# Altium schematic sheet Э3.SchDoc: =title_line_1 + title_line_2
size 420 x 297 mm; ApprovedBy: Мерзлякова; CheckedBy: Кутузов; DrawnBy: Площадная; DocumentNumber: Э3; SheetNumber: 1; SheetTotal: 2; title_line_1: плата; title_line_2: ЕТЗ; document_type: схема электрическая принципиальная; check: Кутузов; AprovedBy: Мерзлякова
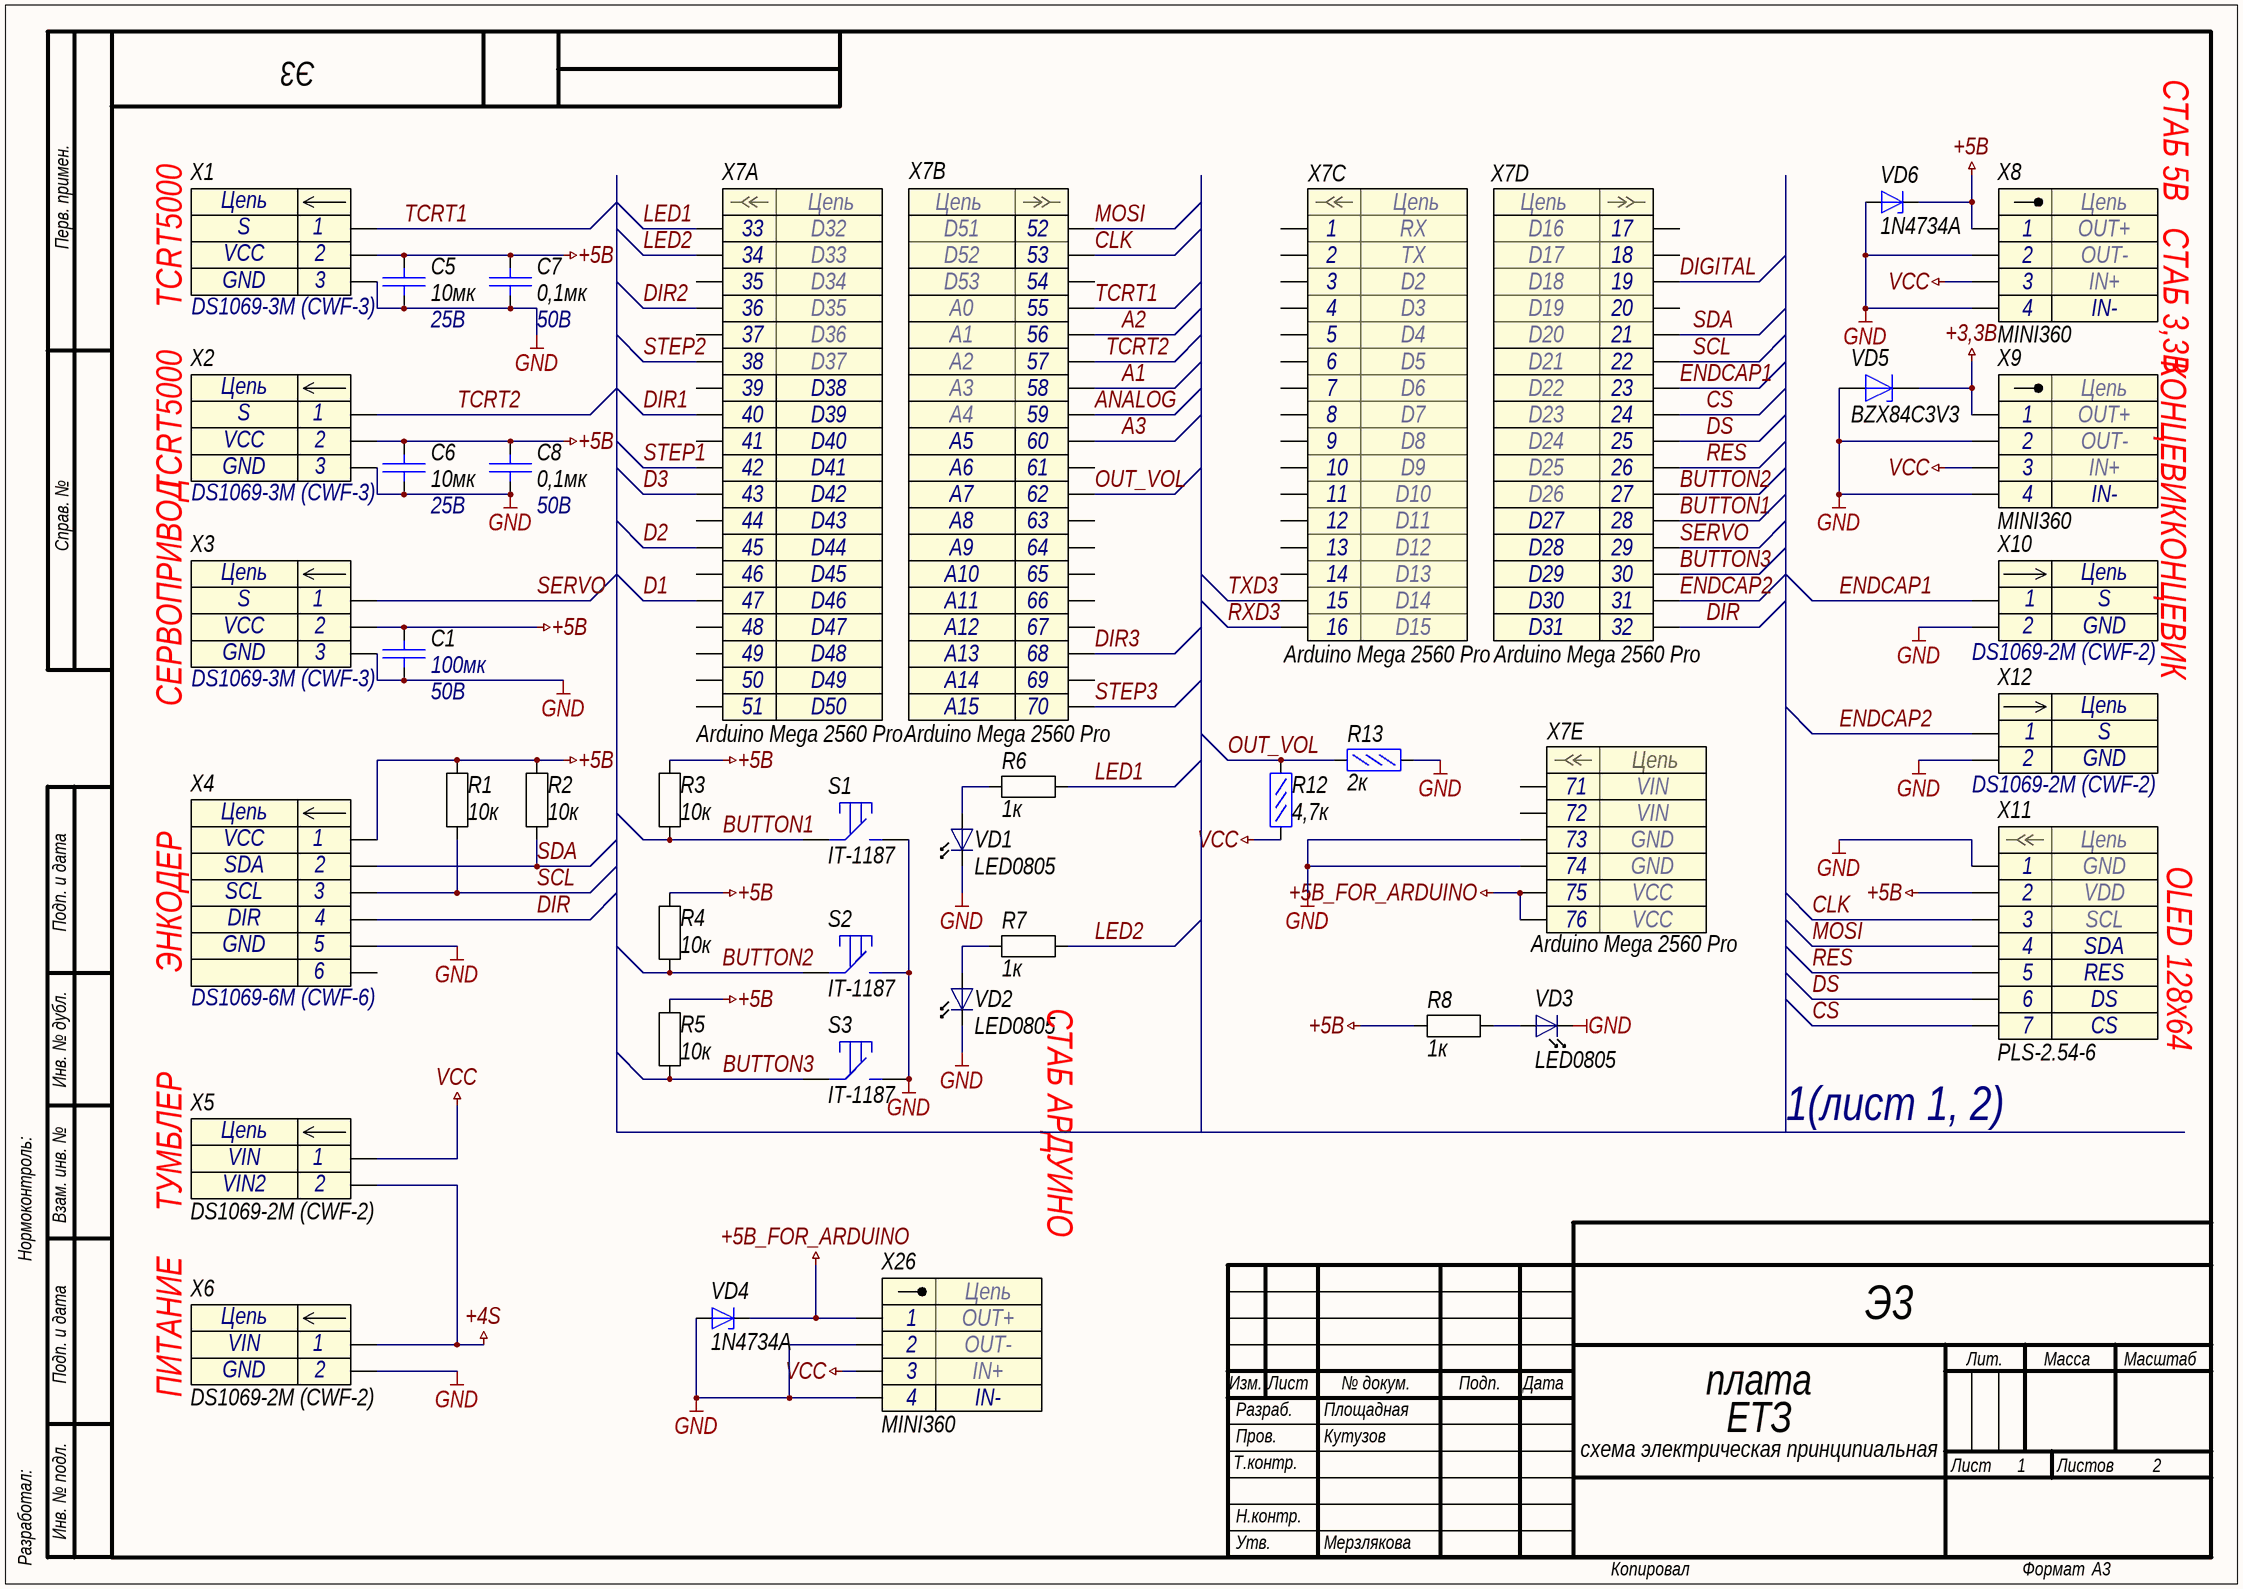
[diagram p0: Э3.SchDoc]

## Parts
C1  Voltage: 50В  [C1210]  (hidden comment: 100мк)
C5  10мк  Voltage: 25В  [C1206]
C6  10мк  Voltage: 25В  [C1206]
C7  0,1мк  Voltage: 50В  [C0603]
C8  0,1мк  Voltage: 50В  [C0603]
R1  10к  [Resistor0805]
R2  10к  [Resistor0805]
R3  10к  [Resistor0805]
R4  10к  [Resistor0805]
R5  10к  [Resistor0805]
R6  1к  [Resistor0805]
R7  1к  [Resistor0805]
R8  1к  [Resistor0805]
R12  4,7к  [R0603]
R13  2к  [R0603]
S1  IT-1187  [it-1187]
S2  IT-1187  [it-1187]
S3  IT-1187  [it-1187]
VD1  LED0805  [LED0805]
VD2  LED0805  [LED0805]
VD3  LED0805  [LED0805]
VD4  1N4734A  [DO-41]
VD5  BZX84C3V3  [SOT23-3]
VD6  1N4734A  [DO-41]
X1  DS1069-3M (CWF-3)  [CWF-3]
X2  DS1069-3M (CWF-3)  [CWF-3]
X3  DS1069-3M (CWF-3)  [CWF-3]
X4  DS1069-6M (CWF-6)  [CWF-6]
X5  DS1069-2M (CWF-2)  [CWF-2]
X6  DS1069-2M (CWF-2)  [CWF-2]
X7  Arduino Mega 2560 Pro  [PBD38]  (parts A,B,C,D,E of 5)
X8  MINI360  [mini360]
X9  MINI360  [mini360]
X10  DS1069-2M (CWF-2)  [CWF-2]
X11  PLS-2.54-6  [PBD8]
X12  DS1069-2M (CWF-2)  [CWF-2]
X26  MINI360  [mini360]

## Nets
+3,3В: VD5.3(K) X9.1
+4S: X5.2 X6.1
+5В: C1.2 C5.2 C6.2 C7.2 C8.2 R1.1 R2.1 R3.2 R4.2 R5.2 R8.1 VD6.2(K) X1.2 X2.2 X3.2 X4.1 X8.1 X11.2
+5В_FOR_ARDUINO: VD4.2(K) X7.75 X7.76 X26.1
GND: C1.1 C5.1 C6.1 C7.1 C8.1 R13.2 S1.2 S2.2 S3.2 VD1.1 VD2.1 VD3.1 VD4.1(A) VD5.1(A) VD6.1(A) X1.3 X2.3 X3.3 X4.5 X6.2 X7.73 X7.74 X8.2 X8.4 X9.2 X9.4 X10.2 X11.1 X12.2 X26.2 X26.4
VCC: R12.1 X5.1 X8.3 X9.3 X26.3
A1: X7.58
A2: X7.56
A3: X7.60
ANALOG: X7.59
BUTTON1: R3.1 S1.1 X7.28
BUTTON2: R4.1 S2.1 X7.27
BUTTON3: R5.1 S3.1 X7.30
CLK: X7.53 X11.3
CS: X7.24 X11.7
D1: X7.47
D2: X7.45
D3: X7.43
DIGITAL: X7.19
DIR: X4.4 X7.32
DIR1: X7.40
DIR2: X7.36
DIR3: X7.68
DS: X7.25 X11.6
ENDCAP1: X7.23 X10.1
ENDCAP2: X7.31 X12.1
LED1: R6.1 X7.33
LED2: R7.1 X7.34
MOSI: X7.52 X11.4
OUT_VOL: R12.2 R13.1 X7.62
RES: X7.26 X11.5
RXD3: X7.16
SCL: R1.2 X4.3 X7.22
SDA: R2.2 X4.2 X7.21
SERVO: X3.1 X7.29
STEP1: X7.42
STEP2: X7.38
STEP3: X7.70
TCRT1: X1.1 X7.55
TCRT2: X2.1 X7.57
TXD3: X7.15
NetR6_2: R6.2 VD1.2
NetR7_2: R7.2 VD2.2
NetR8_2: R8.2 VD3.2

Not connected (* = marked no-connect by the designer): X4 6; X7 1 2 3 4 5 6 7 8 9 10 11 12 13 14 17 18 20 35 37 39 41 44 46 48 49 50 51 54 61 63 64 65 66 67 69 71 72

## Notes on the sheet
- СТАБ 5В
- TCRT5000
- СТАБ 3,3В
- КОНЦЕВИК
- СЕРВОПРИВОД
- OLED 128x64
- ЭНКОДЕР
- (near X11) 1(лист 1, 2)
- ТУМБЛЕР
- СТАБ АРДУИНО
- ПИТАНИЕ
- Перв. примен.
- Справ. №
- Подп. и дата
- Инв. № дубл.
- Нормоконтроль:
- Взам. инв. №
- Изм.
- Лист
- № докум.
- Подп.
- Дата
- Лит.
- Масса
- Масштаб
- Т.контр.
- Пров.
- Разраб.
- Листов
- Разработал:
- Инв. № подл.
- Н.контр.
- Утв.
- Копировал
- Формат
- А3
- (in symbol Arduino Mega 2560 Pro, part A) Цепь; D32; D33; D34; D35; D36; D37; D38; D39; D40; D41; D42; D43; D44; D45; D46; D47; D48; D49; D50
- (in symbol Arduino Mega 2560 Pro, part B) Цепь; D51; D52; D53; A0; A1; A2; A3; A4; A5; A6; A7; A8; A9; A10; A11; A12; A13; A14; A15
- (in symbol Arduino Mega 2560 Pro, part C) Цепь; RX; TX; D2; D3; D4; D5; D6; D7; D8; D9; D10; D11; D12; D13; D14; D15
- (in symbol Arduino Mega 2560 Pro, part D) Цепь; D16; D17; D18; D19; D20; D21; D22; D23; D24; D25; D26; D27; D28; D29; D30; D31
- (in symbol Arduino Mega 2560 Pro, part E) Цепь; VIN; GND; VCC
- (in symbol CWF-2) Цепь
- (in symbol CWF-3) Цепь
- (in symbol CWF-6) Цепь
- (in symbol mini360) Цепь; OUT+; OUT-; IN+; IN-
- (in symbol PBD8) Цепь

## Library data of the parts
C1 = CC0603JRNPO9BN220: Конденсатор кер. 100мк 50В; Manufacturer: Yageo; TKE: NP0; Name: CC0603JRNPO9BN220; Value: 100мк
C5 C6 = CC1206KKX7R8BB106: Конденсатор кер. 10мкФ 25В; Manufacturer: Yageo; TKE: X7R; Name: CC1206KKX7R8BB106; Value: 10мк
C7 C8 = GRM188R71H104KA93D: Конденсатор кер. 0,1мкФ 50В X7R; Manufacturer: Murata; Name: GRM188R71H104KA93D; TKE: X7R; Value: 0,1мк
R1-R5 = RESISTOR: nam: 10к
R6-R8 = RESISTOR: nam: резистор
R12 = RC0603FR-074K7L: Резистор 4,7кОм 0,063Вт 1%; Manufacturer: YAGEO; Name: RC0603FR-074K7L; Tolerance: 1%; Value: 4,7к
R13 = RC0603FR-072KL: Резистор 2кОм 0,063Вт 1%; Manufacturer: YAGEO; Name: RC0603FR-072KL; Tolerance: 1%; Value: 2к
S1-S3 = IT-1187: тактовая кнопка SMD; Name: IT-1187
VD4 VD6 = 1N4734A: Стабилитрон 5.6В, 5%, 1Вт, 1N4734A; Voltage MAX: 5.88; Voltage MIN: 5.32; Name: 1N4734A; ComponentLink1Description: HelpURL; ComponentLink1URL: https://www.promelec.ru/fs/sources/54/98/aa/7a/f161d9308e45db5c55639eb6.pdf
VD5 = BZX84C3V3: Стабилитрон 3,3В; Name: BZX84C3V3
X1-X3 = CWF-3: Разъем - 3 конт. прямая вилка на плату; Contact_1: S; Contact_2: VCC; Contact_3: GND; Name: DS1069-3M (CWF-3)
X4 = CWF-6: Разъем - 6 конт. прямая вилка на плату; Contact_1: VCC; Contact_2: SDA; Contact_3: SCL; Contact_4: DIR; Contact_5: GND; Name: DS1069-6M (CWF-6)
X5 = CWF-2: Разъем - 2 конт. прямая вилка на плату; Contact_1: VIN; Contact_2: VIN2; Name: DS1069-2M (CWF-2)
X6 = CWF-2: Разъем - 2 конт. прямая вилка на плату; Contact_1: VIN; Contact_2: GND; Name: DS1069-2M (CWF-2)
X8 X9 X26 = mini360: стаб 18 на 12 мм
X10 X12 = CWF-2: Разъем - 2 конт. прямая вилка на плату; Contact_1: S; Contact_2: GND; Name: DS1069-2M (CWF-2)
X11 = PBD8: Contact_1: GND; Contact_2: VDD; Contact_3: SCL; Contact_4: SDA; Contact_5: RES; Contact_6: DS; Contact_7: CS; nam: PLS-2.54-6; Contact_8: DS; Parameter 1: *
X7 = Arduino Mega 2560 Pro: nam: Arduino Mega 2560 Pro